# EAGLE design GCtoUSB_Current (EAGLE 5.07)
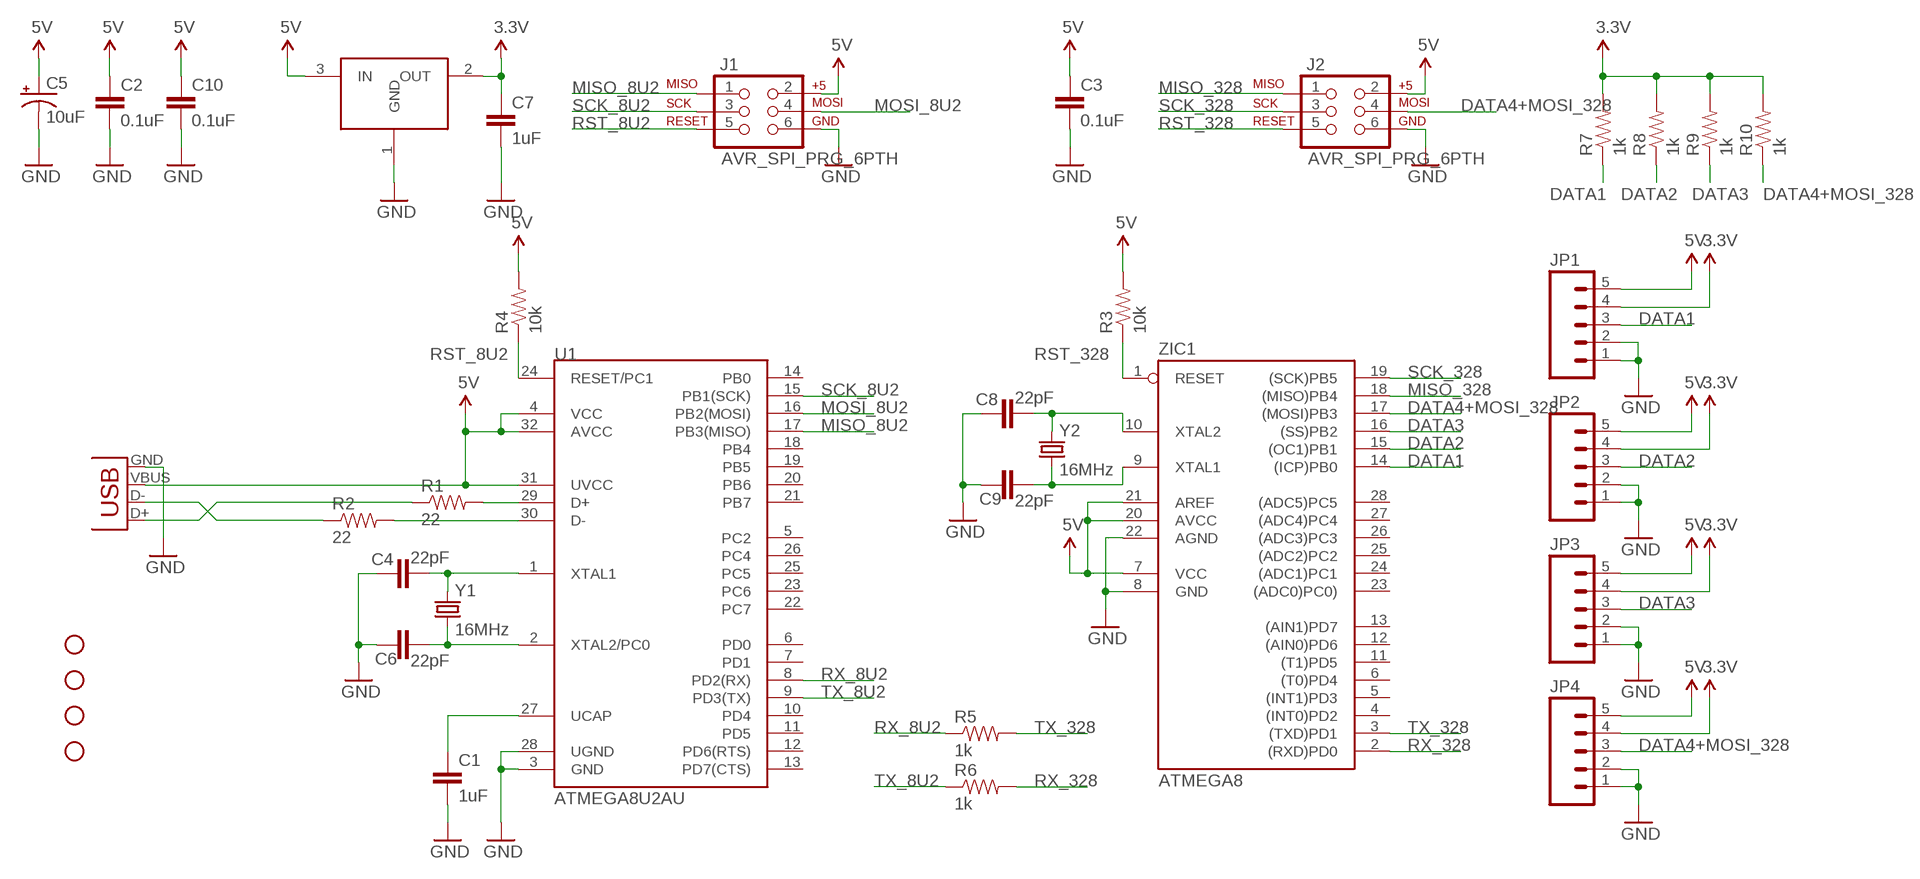
[diagram p0: schematic, sheet 1]

## Parts
C1  1uF  CAPPTH1  [CAP-PTH-5MM]
C2  0.1uF  CAPPTH  [CAP-PTH-SMALL]
C3  0.1uF  CAPPTH  [CAP-PTH-SMALL]
C4  22pF  CAPPTH  [CAP-PTH-SMALL]
C5  10uF  CAP_POLPTH2  [CPOL-RADIAL-10UF-25V]
C6  22pF  CAPPTH  [CAP-PTH-SMALL]
C7  1uF  CAPPTH1  [CAP-PTH-5MM]
C8  22pF  CAPPTH  [CAP-PTH-SMALL]
C9  22pF  CAPPTH  [CAP-PTH-SMALL]
C10  0.1uF  CAPPTH  [CAP-PTH-SMALL]
J1  AVR_SPI_PRG_6PTH  [2X3]
J2  AVR_SPI_PRG_6PTH  [2X3]
JP1  M05PTH  [1X05]
JP2  M05PTH  [1X05]
JP3  M05PTH  [1X05]
JP4  M05PTH  [1X05]
JP5  STAND-OFF  [STAND-OFF]
JP6  STAND-OFF  [STAND-OFF]
JP7  STAND-OFF  [STAND-OFF]
JP8  STAND-OFF  [STAND-OFF]
R1  22  RESISTORPTH-1/4W  [AXIAL-0.4]
R2  22  RESISTORPTH-1/4W  [AXIAL-0.4]
R3  10k  RESISTORPTH-1/4W  [AXIAL-0.4]
R4  10k  RESISTORPTH-1/4W  [AXIAL-0.4]
R5  1k  RESISTORPTH-1/4W  [AXIAL-0.4]
R6  1k  RESISTORPTH-1/4W  [AXIAL-0.4]
R7  1k  RESISTORPTH-1/4W  [AXIAL-0.4]
R8  1k  RESISTORPTH-1/4W  [AXIAL-0.4]
R9  1k  RESISTORPTH-1/4W  [AXIAL-0.4]
R10  1k  RESISTORPTH-1/4W  [AXIAL-0.4]
U1  ATMEGA8U2AU  [TQFP32-08]
U$16  TO220-LDOTO  [TO220V]
X1  USB-MB-H  [USB-MB-H]
Y1  16MHz  CRYSTALHC49US  [HC49US]
Y2  16MHz  CRYSTALHC49US  [HC49US]
ZIC1  ATMEGA8  AT90S4433P  [DIL28-3]

## Nets
3.3V: C7.1 JP1.4 JP2.4 JP3.4 JP4.4 R7.P$2 R8.P$2 R9.P$2 R10.P$2 U$16.2(OUT)
5V: C2.1 C3.1 C5.1(+) C10.1 J1.2 J2.2 JP1.5 JP2.5 JP3.5 JP4.5 R3.P$2 R4.P$2 U1.4(VCC) U1.31(UVCC) U1.32(AVCC) U$16.3(IN) X1.VBUS ZIC1.7(VCC) ZIC1.20(AVCC) ZIC1.21(AREF)
DATA1: JP1.3 R7.P$1 ZIC1.14((ICP)PB0)
DATA2: JP2.3 R8.P$1 ZIC1.15((OC1)PB1)
DATA3: JP3.3 R9.P$1 ZIC1.16((SS)PB2)
DATA4+MOSI_328: J2.4 JP4.3 R10.P$1 ZIC1.17((MOSI)PB3)
GND: C1.2 C2.2 C3.2 C4.2 C5.2(-) C6.2 C7.2 C8.2 C9.2 C10.2 J1.6 J2.6 JP1.1 JP1.2 JP2.1 JP2.2 JP3.1 JP3.2 JP4.1 JP4.2 U1.3(GND) U1.28(UGND) U$16.1(GND) X1.GND ZIC1.8(GND) ZIC1.22(AGND)
MISO_8U2: J1.1 U1.17(PB3(MISO))
MISO_328: J2.1 ZIC1.18((MISO)PB4)
MOSI_8U2: J1.4 U1.16(PB2(MOSI))
N$1: C8.1 Y2.2 ZIC1.10(XTAL2)
N$2: C9.1 Y2.1 ZIC1.9(XTAL1)
N$3: R1.P$2 U1.29(D+)
N$4: R2.P$2 U1.30(D-)
N$5: R1.P$1 X1.D+
N$6: R2.P$1 X1.D-
N$8: C4.1 U1.1(XTAL1) Y1.2
N$9: C6.1 U1.2(XTAL2/PC0) Y1.1
N$12: C1.1 U1.27(UCAP)
RST_8U2: J1.5 R4.P$1 U1.24(RESET/PC1)
RST_328: J2.5 R3.P$1 ZIC1.1(RESET)
RX_8U2: R5.P$1 U1.8(PD2(RX))
RX_328: R6.P$2 ZIC1.2((RXD)PD0)
SCK_8U2: J1.3 U1.15(PB1(SCK))
SCK_328: J2.3 ZIC1.19((SCK)PB5)
TX_8U2: R6.P$1 U1.9(PD3(TX))
TX_328: R5.P$2 ZIC1.3((TXD)PD1)
Unconnected: U1.5(PC2) U1.6(PD0) U1.7(PD1) U1.10(PD4) U1.11(PD5) U1.12(PD6(RTS)) U1.13(PD7(CTS)) U1.14(PB0) U1.18(PB4) U1.19(PB5) U1.20(PB6) U1.21(PB7) U1.22(PC7) U1.23(PC6) U1.25(PC5) U1.26(PC4) ZIC1.4((INT0)PD2) ZIC1.5((INT1)PD3) ZIC1.6((T0)PD4) ZIC1.11((T1)PD5) ZIC1.12((AIN0)PD6) ZIC1.13((AIN1)PD7) ZIC1.23((ADC0)PC0)) ZIC1.24((ADC1)PC1) ZIC1.25((ADC2)PC2) ZIC1.26((ADC3)PC3) ZIC1.27((ADC4)PC4) ZIC1.28((ADC5)PC5)

## Library data of the parts
C1-C4 C6-C10 = SparkFun:CAP: Capacitor Standard 0603 ceramic capacitor, and 0.1" leaded capacitor.
C5 = SparkFun:CAP_POL: Capacitor Polarized These are standard SMD and PTH capacitors. Normally 10uF, 47uF, and 100uF in electrolytic and tantalum varieties. Always verify the external diameter of the through hole cap, it varies with capacity, voltage, and manufacturer. The EIA devices should be standard.
J1 J2 = SparkFun:AVR_SPI_PRG_6: AVR ISP 6 Pin This is the reduced ISP connector for AVR programming. Common on Arduino. This footprint will take up less PCB space and can be used with a 10-pin to 6-pin adapter such as SKU: BOB-08508
JP1-JP4 = SparkFun:M05: Header 5 Standard 5-pin 0.1" header. Use with straight break away headers (SKU : PRT-00116), right angle break away headers (PRT-00553), swiss pins (PRT-00743), machine pins (PRT-00117), and female headers (PRT-00115). Molex polarized connector foot print use with SKU : PRT-08230 with associated crimp pins and housings.
JP5-JP8 = SparkFun:STAND-OFF: Stand Off This is the mechanical footprint for a #4 phillips button head screw. Use the keepout ring to avoid running the screw head into surrounding components. SKU : PRT-00447
R1-R10 = SparkFun:RESISTOR: Resistor Basic schematic elements and footprints for 0603, 1206, and PTH resistors.
U1 = SparkFun:ATMEGA8U2: Atmel 8-bit Microcontroller with 8/16/32K Bystes of ISP Flash and USB Controller. ATmega8U2, ATmega16U2, and ATmega32U2
U$16 = SparkFun:TO220-LDO
X1 = SparkFun:USB: USB Connectors USB-B-PTH is fully proven SKU : PRT-00139 USB-miniB is fully proven SKU : PRT-00587 USB-A-PCB is untested. USB-A-H is throughly reviewed, but untested. Spark Fun Electronics SKU : PRT-00437 USB-B-SMT is throughly reviewed, but untested. Needs silkscreen touching up. USB-A-S has not been used/tested USB-MB-H has not been used/tested
Y1 Y2 = SparkFun:CRYSTAL: Crystals Various standard crystals. Proven footprints. Spark Fun Electronics SKU : COM-00534
ZIC1 = atmel:AT90S4433: MICROCONTROLLER 4 Kbytes FLASH 128 bytes SRAM 256 bytes EEPROM UART 6-channel 10 bit ADC

## Net classes
0 default: width 0.203 mm, clearance 0.203 mm

## Board
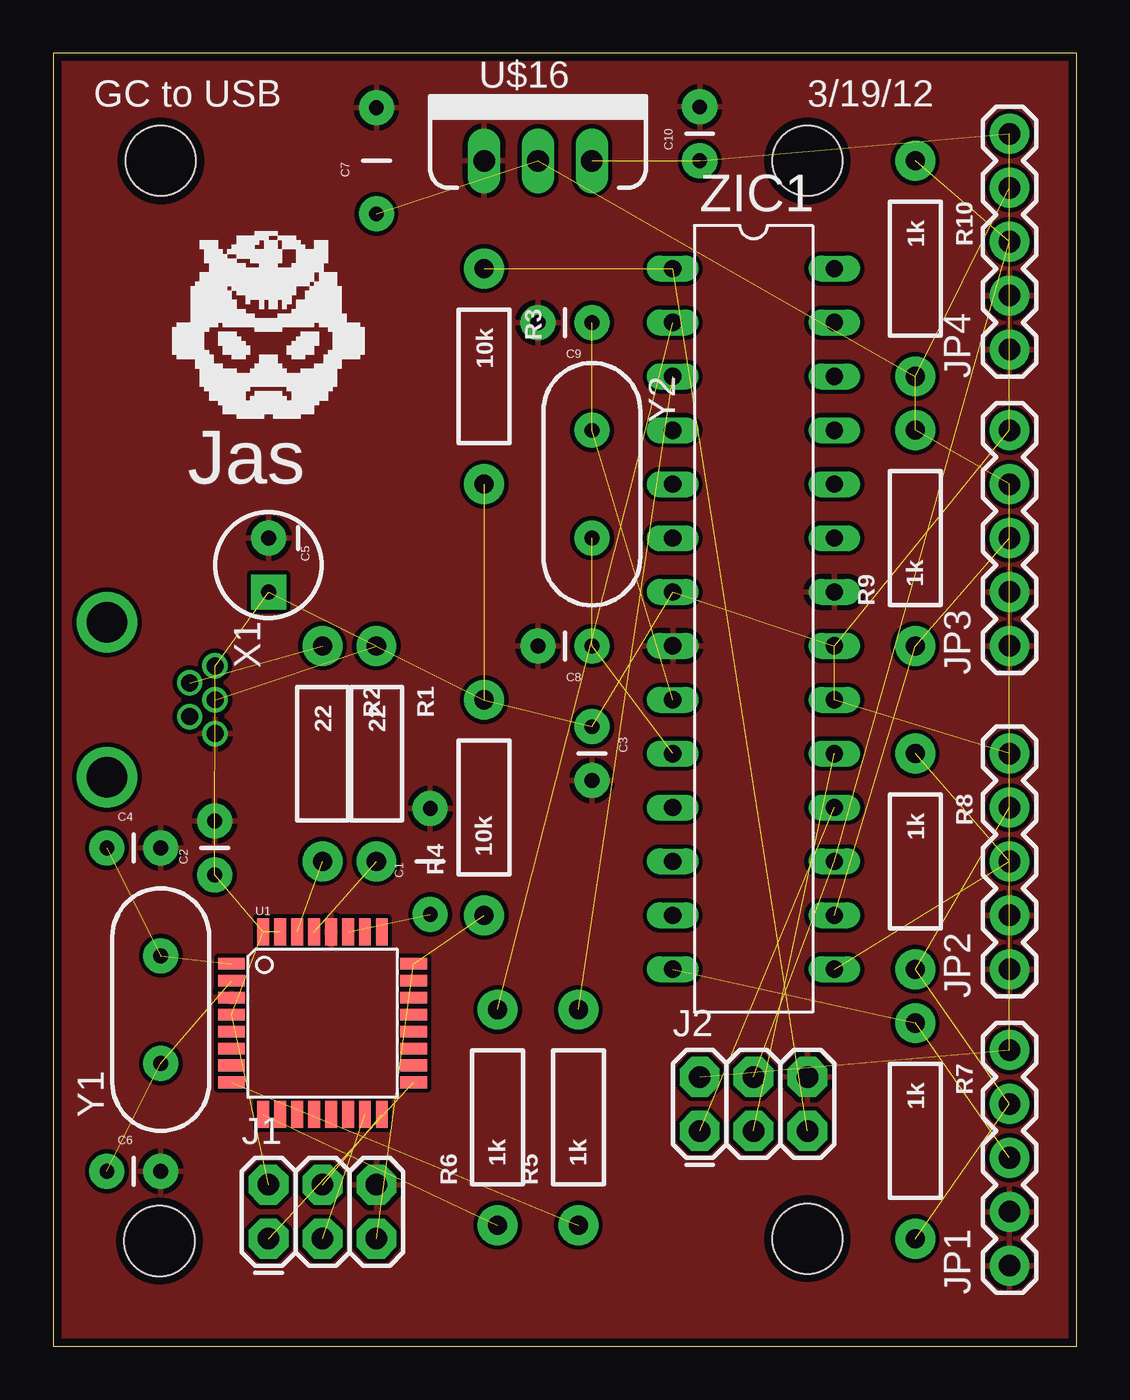
[diagram p1: board, top side]
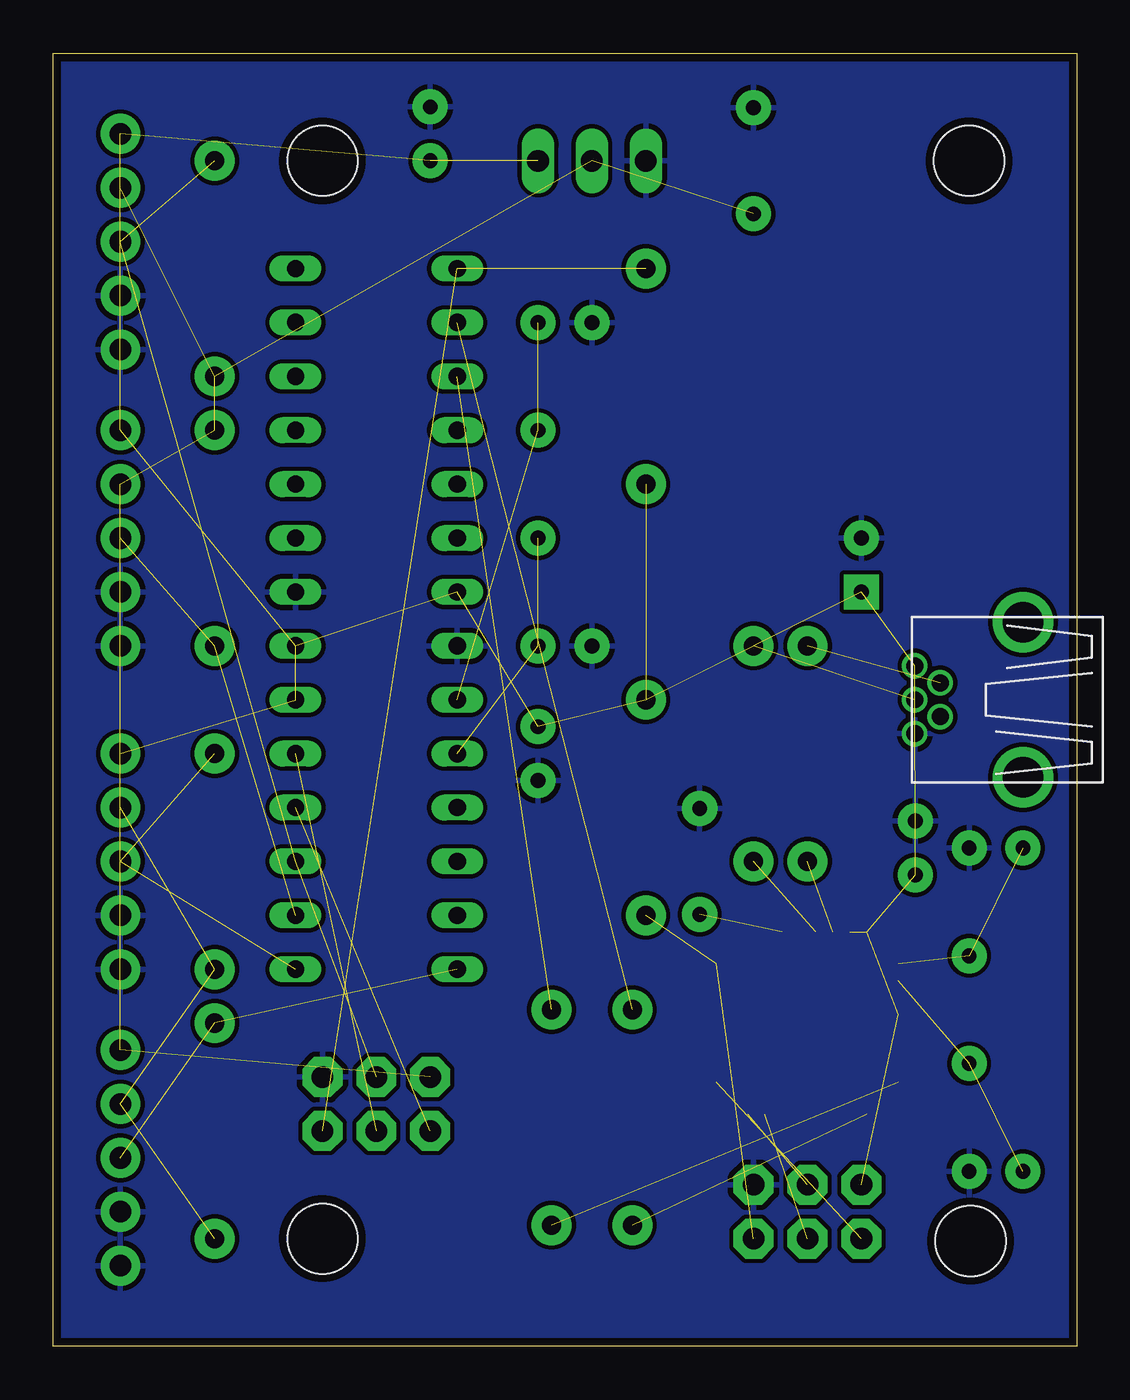
[diagram p2: board, bottom side, seen from below]

Size 48.26 x 60.96 mm. Coordinates in mm from the lower left corner, seen from the top.
Outline: 0,0 48.26,0 48.26,60.96 0,60.96 0,0
Copper layers (1*16): Top 0.0356mm / dielectric 1.5011mm / Bottom 0.0356mm
Design rules "LaenPCBOrder": minimum track width 6mil, minimum drill 13mil, track to track 6mil, track to pad 6mil, pad to pad 6mil, via to via 6mil, smd to smd 6mil, copper to edge 15mil, drill to drill 6mil, minimum pad ring 7mil, minimum via ring 7mil, stop-mask expansion 4mil, vias tented up to drill 0mil, thermal gap 10mil

### Footprints (pad centres in the part's own frame; a part is rotated, then mirrored left to right if it is on the bottom)
CAP-PTH-5MM = drill 0.7 pad 1.651 round: 1 -2.5,0; 2 2.5,0
CAP-PTH-SMALL = drill 0.7 pad 1.651 round: 1 0,0; 2 2.54,0
CPOL-RADIAL-10UF-25V = drill 0.7 pad 1.651 square: 1 1.27,0 | drill 0.7 pad 1.651 round: 2 -1.27,0
2X3 = drill 1.016 pad 1.88 octagon: 1 0,0; 2 0,2.54; 3 2.54,0; 4 2.54,2.54; 5 5.08,0; 6 5.08,2.54
1X05 = drill 1.016 pad 1.88 round: 1 0,0; 2 2.54,0; 3 5.08,0; 4 7.62,0; 5 10.16,0
STAND-OFF = hole 3.302: 0,0
AXIAL-0.4 = drill 0.9 pad 1.88 round: P$1 -5.08,0; P$2 5.08,0
TQFP32-08 = smd 1.27 x 0.559: 1 -4.293,2.8; 2 -4.293,2; 3 -4.293,1.2; 4 -4.293,0.4; 5 -4.293,-0.4; 6 -4.293,-1.2; 7 -4.293,-2; 8 -4.293,-2.8; 17 4.293,-2.8; 18 4.293,-2; 19 4.293,-1.2; 20 4.293,-0.4; 21 4.293,0.4; 22 4.293,1.2; 23 4.293,2; 24 4.293,2.8 | smd 0.559 x 1.27: 9 -2.8,-4.293; 10 -2,-4.293; 11 -1.2,-4.293; 12 -0.4,-4.293; 13 0.4,-4.293; 14 1.2,-4.293; 15 2,-4.293; 16 2.8,-4.293; 25 2.8,4.293; 26 2,4.293; 27 1.2,4.293; 28 0.4,4.293; 29 -0.4,4.293; 30 -1.2,4.293; 31 -2,4.293; 32 -2.8,4.293
TO220V = drill 1.016 long: 1 -2.54,0; 2 0,0; 3 2.54,0
USB-MB-H = drill 0.8 round: D+ 5.1,0; D- 3.9,0.8; GND 5.1,-1.6; ID 3.9,-0.8; VBUS 5.1,1.6 | drill 1.9 round: P$6 0,-3.65; P$7 0,3.65
HC49US = drill 0.7 pad 1.651 round: 1 -2.54,0; 2 2.54,0
DIL28-3 = drill 0.813 long: 1 -16.51,-3.81; 2 -13.97,-3.81; 3 -11.43,-3.81; 4 -8.89,-3.81; 5 -6.35,-3.81; 6 -3.81,-3.81; 7 -1.27,-3.81; 8 1.27,-3.81; 9 3.81,-3.81; 10 6.35,-3.81; 11 8.89,-3.81; 12 11.43,-3.81; 13 13.97,-3.81; 14 16.51,-3.81; 15 16.51,3.81; 16 13.97,3.81; 17 11.43,3.81; 18 8.89,3.81; 19 6.35,3.81; 20 3.81,3.81; 21 1.27,3.81; 22 -1.27,3.81; 23 -3.81,3.81; 24 -6.35,3.81; 25 -8.89,3.81; 26 -11.43,3.81; 27 -13.97,3.81; 28 -16.51,3.81

### Placement (x,y rotation side)
C1  17.78,22.86 90 top
C2  7.62,22.23 90 top
C3  25.4,29.21 270 top
C4  2.54,23.5 0 top
C5  10.16,36.83 270 top
C6  2.54,8.26 0 top
C7  15.24,55.88 90 top
C8  25.4,33.02 180 top
C9  25.4,48.26 180 top
C10  30.48,55.88 90 top
J1  10.16,5.08 0 top
J2  30.48,10.16 0 top
JP1  45.09,3.81 90 top
JP2  45.09,17.78 90 top
JP3  45.09,33.02 90 top
JP4  45.09,46.99 90 top
JP5  5.02,4.97 0 top
JP6  35.56,5.08 0 top
JP7  5.08,55.88 0 top
JP8  35.56,55.88 0 top
R1  15.24,27.94 270 top
R2  12.7,27.94 270 top
R3  20.32,45.72 270 top
R4  20.32,25.4 90 top
R5  24.77,10.79 90 top
R6  20.95,10.79 90 top
R7  40.64,10.16 270 top
R8  40.64,22.86 270 top
R9  40.64,38.1 90 top
R10  40.64,50.8 270 top
U1  12.7,15.24 0 top
U$16  22.86,55.88 0 top
X1  2.54,30.48 0 top
Y1  5.08,15.88 90 top
Y2  25.4,40.64 270 top
ZIC1  33.02,34.29 270 top

### Tracks (layer width: path | path; a pad name or v marks a point on that pad's centre or on a via)
3.3V  (9 unrouted)
5V  (19 unrouted)
DATA1  (2 unrouted)
DATA2  (2 unrouted)
DATA3  (2 unrouted)
DATA4+MOSI_328  (3 unrouted)
GND
  pour Top: 0,0 0,60.96 48.26,60.96 48.26,0
  pour Bottom: 0,0 0,60.96 48.26,60.96 48.26,0
MISO_8U2  (1 unrouted)
MISO_328  (1 unrouted)
MOSI_8U2  (1 unrouted)
N$1  (2 unrouted)
N$2  (2 unrouted)
N$3  (1 unrouted)
N$4  (1 unrouted)
N$5  (1 unrouted)
N$6  (1 unrouted)
N$8  (2 unrouted)
N$9  (2 unrouted)
N$12  (1 unrouted)
RST_8U2  (2 unrouted)
RST_328  (2 unrouted)
RX_8U2  (1 unrouted)
RX_328  (1 unrouted)
SCK_8U2  (1 unrouted)
SCK_328  (1 unrouted)
TX_8U2  (1 unrouted)
TX_328  (1 unrouted)

### Text on the board
tPlace: GC to USB | 3/19/12 | Jas